# Altium project Guitar_Amp_Project.PrjPcb
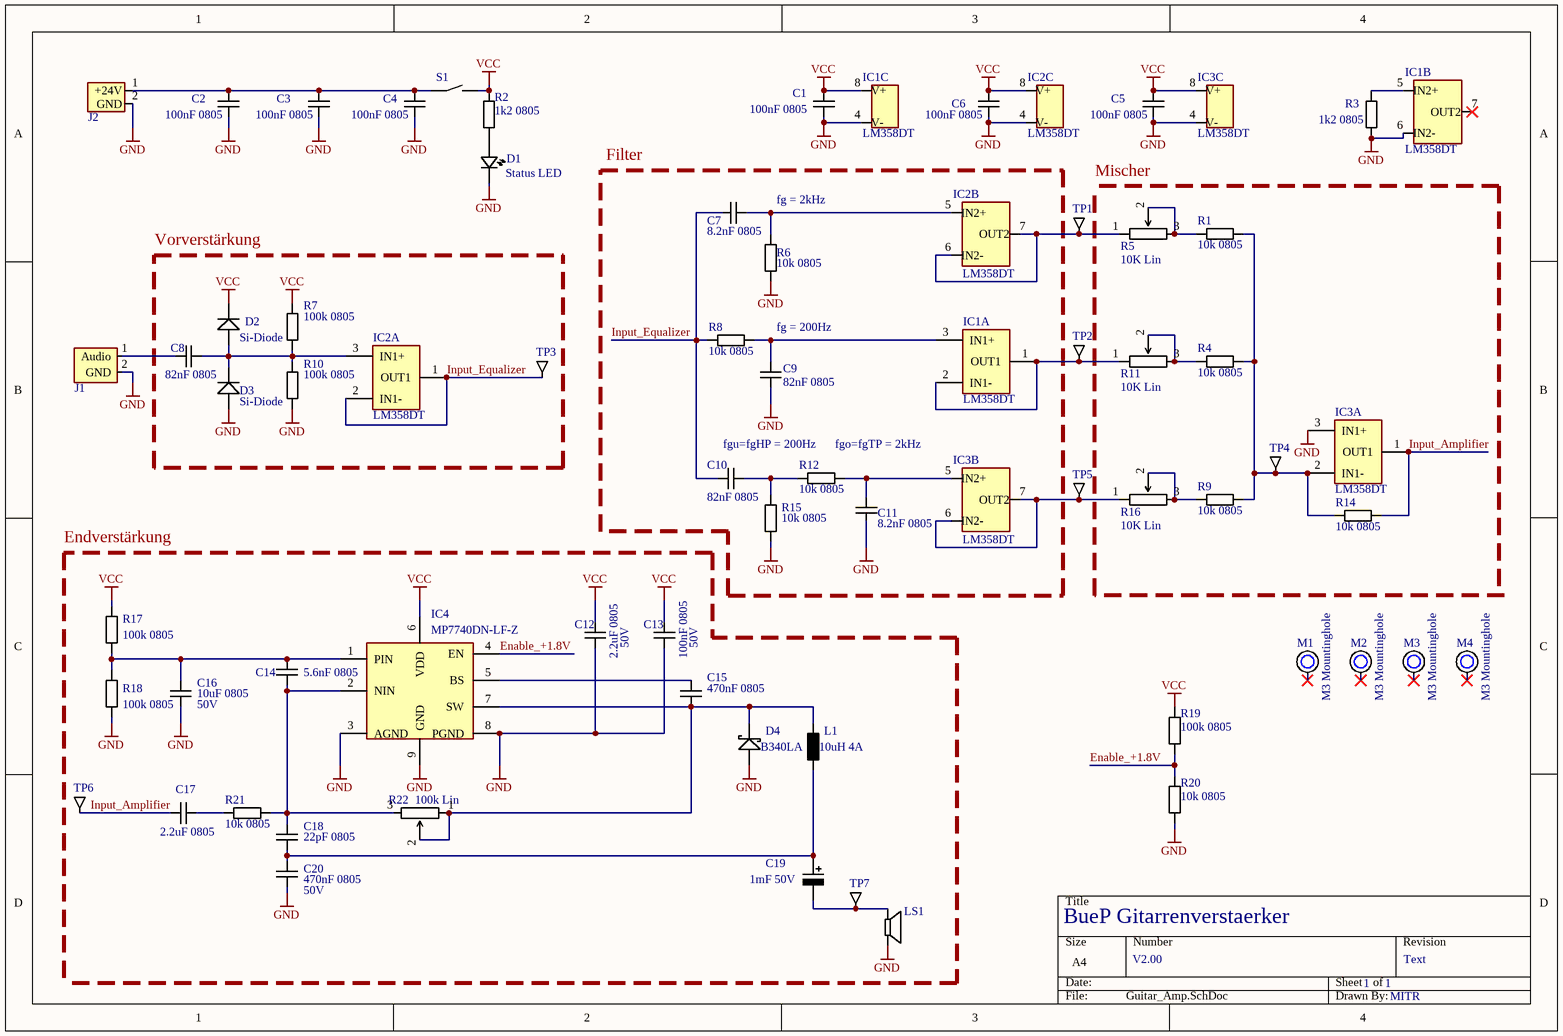
[diagram p0: Guitar_Amp.SchDoc]
1 sheet, 65 parts. Net scope: global (net labels, ports and power ports of the same name join across sheets).
Board file: Guitar_Amp_PCB.PcbDoc

## Sheet Guitar_Amp.SchDoc
size A4; SheetNumber: 1; SheetTotal: 1

### Parts
C1  100nF 0805  [C Template for 0805]
C2  100nF 0805  [C Template for 0805]
C3  100nF 0805  [C Template for 0805]
C4  100nF 0805  [C Template for 0805]
C5  100nF 0805  [C Template for 0805]
C6  100nF 0805  [C Template for 0805]
C7  8.2nF 0805  [C Template for 0805]
C8  82nF 0805  [C Template for 0805]
C9  82nF 0805  [C Template for 0805]
C10  82nF 0805  [C Template for 0805]
C11  8.2nF 0805  [C Template for 0805]
C12  2.2uF 0805  [C Template for 0805]
C13  100nF 0805  [C Template for 0805]
C14  5.6nF 0805  [C Template for 0805]
C15  470nF 0805  [C Template for 0805]
C16  10uF 0805  [C Template for 0805]
C17  2.2uF 0805  [C Template for 0805]
C18  22pF 0805  [C Template for 0805]
C19  1mF 50V  [C 1mF 50V Elko]
C20  470nF 0805  [C Template for 0805]
D1  ?F  [5mm LED Red]  (value not drawn)
D2  Si-Diode  [Si-Diode Footprint]
D3  Si-Diode  [Si-Diode Footprint]
D4  B340LA  [B340LA-13-F Schottky Diode]
IC1  LM358DT  [SOIC127P600X175-8N]  (parts A,B,C of 5)
IC2  LM358DT  [SOIC127P600X175-8N]  (parts A,B,C of 5)
IC3  LM358DT  [SOIC127P600X175-8N]  (parts A,B,C of 5)
IC4  MP7740DN-LF-Z  [SOIC127P600X170-9N]
J1  Audio-Jack  [Audio Inputjack]  (value not drawn)
J2  ?F 080  [Power Supply Input]  (value not drawn)
L1  10uH 4A  [Inductor 10uH / 4A]
LS1  4 Ohm  [4_Ohm_Speaker]  (value not drawn)
M1  M3 Mountinghole  [M3 Moutinghole]
M2  M3 Mountinghole  [M3 Moutinghole]
M3  M3 Mountinghole  [M3 Moutinghole]
M4  M3 Mountinghole  [M3 Moutinghole]
R1  10k 0805  [R Template for 0805]
R2  1k2 0805  [R Template for 0805]
R3  1k2 0805  [R Template for 0805]
R4  10k 0805  [R Template for 0805]
R5  10K Lin  [Poti_standard_footprint]
R6  10k 0805  [R Template for 0805]
R7  100k 0805  [R Template for 0805]
R8  10k 0805  [R Template for 0805]
R9  10k 0805  [R Template for 0805]
R10  100k 0805  [R Template for 0805]
R11  10K Lin  [Poti_standard_footprint]
R12  10k 0805  [R Template for 0805]
R14  10k 0805  [R Template for 0805]
R15  10k 0805  [R Template for 0805]
R16  10K Lin  [Poti_standard_footprint]
R17  100k 0805  [R Template for 0805]
R18  100k 0805  [R Template for 0805]
R19  100k 0805  [R Template for 0805]
R20  10k 0805  [R Template for 0805]
R21  10k 0805  [R Template for 0805]
R22  100k Lin  [Poti_standard_footprint]
S1  ?H 0805  [Switch]  (value not drawn)
TP1  Testpoint_2.54mm  [Testpoint_2.54mm]  (value not drawn)
TP2  Testpoint_2.54mm  [Testpoint_2.54mm]  (value not drawn)
TP3  Testpoint_2.54mm  [Testpoint_2.54mm]  (value not drawn)
TP4  Testpoint_2.54mm  [Testpoint_2.54mm]  (value not drawn)
TP5  Testpoint_2.54mm  [Testpoint_2.54mm]  (value not drawn)
TP6  Testpoint_2.54mm  [Testpoint_2.54mm]  (value not drawn)
TP7  Testpoint_2.54mm  [Testpoint_2.54mm]  (value not drawn)

### Blocks framed on the sheet
Filter: C7 C9-C11 IC1-IC3 R6 R8 R12 R15
Vorverstärkung: C8 D2 D3 IC2 R7 R10 TP3
Endverstärkung: C12-C20 D4 IC4 L1 LS1 R17 R18 R21 R22 TP6 TP7

### Nets
GND: C1.2 C2.2 C3.2 C4.2 C5.2 C6.2 C9.1 C11.1 C12.1 C13.1 C16.1 C20.1 D1.2(GND) D3.1 D4.1 IC1.4(V-) IC1.6(IN2-) IC2.4(V-) IC3.3(IN1+) IC3.4(V-) IC4.3(AGND) IC4.8(PGND) IC4.9(GND) J1.2(GND) J2.2(GND) LS1.2 R3.1 R6.1 R10.1 R15.1 R18.1 R20.1
VCC: C1.1 C5.1 C6.1 C12.2 C13.2 D2.2 IC1.8(V+) IC2.8(V+) IC3.8(V+) IC4.6(VDD) R2.2 R7.2 R17.2 R19.2 S1.1
Enable_+1.8V: IC4.4(EN) R19.1 R20.2
Input_Amplifier: C17.1 IC3.1(OUT1) R14.1 TP6.1
Input_Equalizer: C7.1 C10.1 IC2.1(OUT1) IC2.2(IN1-) R8.1 TP3.1
NetC2_1: C2.1 C3.1 C4.1 J2.1(+24V) S1.2
NetC7_2: C7.2 IC2.5(IN2+) R6.2
NetC8_1: C8.1 J1.1(Audio)
NetC8_2: C8.2 D2.1 D3.2 IC2.3(IN1+) R7.1 R10.2
NetC9_2: C9.2 IC1.3(IN1+) R8.2
NetC10_2: C10.2 R12.2 R15.2
NetC11_2: C11.2 IC3.5(IN2+) R12.1
NetC14_1: C14.1 C18.2 IC4.2(NIN) R21.1 R22.3(OUT9)
NetC14_2: C14.2 C16.2 IC4.1(PIN) R17.1 R18.2
NetC15_1: C15.1 D4.2 IC4.7(SW) L1.2 R22.1 R22.2
NetC15_2: C15.2 IC4.5(BS)
NetC17_2: C17.2 R21.2
NetC18_1: C18.1 C19.1 C20.2 L1.1
NetC19_2: C19.2 LS1.1 TP7.1
NetD1_1: D1.1(+24V) R2.1
NetIC1_1: IC1.1(OUT1) IC1.2(IN1-) R11.1 TP2.1
NetIC1_5: IC1.5(IN2+) R3.2
NetIC2_6: IC2.6(IN2-) IC2.7(OUT2) R5.1 TP1.1
NetIC3_2: IC3.2(IN1-) R1.2 R4.2 R9.2 R14.2 TP4.1
NetIC3_6: IC3.6(IN2-) IC3.7(OUT2) R16.1 TP5.1
NetR1_1: R1.1 R5.2 R5.3(OUT9)
NetR4_1: R4.1 R11.2 R11.3(OUT9)
NetR9_1: R9.1 R16.2 R16.3(OUT9)

Not connected (* = marked no-connect by the designer): IC1 7(OUT2)*; M1 1*; M2 1*; M3 1*; M4 1*

### Notes on the sheet
- (near D1) Status LED
- Mischer
- fg = 2kHz
- fg = 200Hz
- fgu=fgHP = 200Hz
- fgo=fgTP = 2kHz
- 50V
- (near C16) 50V
- (near C20) 50V
- BueP Gitarrenverstaerker
- V2.00
- 1
- Text
- MITR

### Library data of the parts
C1-C11 C13-C16 C18 C20 L1 R1-R4 R6-R10 R12 R14 R15 R17-R21 = RC0805FR-07100RP: Manufacturer_Name: KEMET; Geometry.Height: 0.6mm; Manufacturer_Part_Number: RC0805FR-07100RP; Mouser Part Number: 603-RC0805FR-07100RP; Mouser Price/Stock: https://www.mouser.co.uk/ProductDetail/YAGEO/RC0805FR-07100RP?qs=oypCK0zG324cSp99F0GBZw%3D%3D; Arrow Part Number: RC0805FR-07100RP; Arrow Price/Stock: https://www.arrow.com/en/products/rc0805fr-07100rp/yageo?region=nac; Datasheet Link: https://www.arrow.com/en/products/rc0805fr-07100rp/yageo?region=nac
C12 C17 = 2.2uF 0805: Manufacturer_Name: KEMET; Manufacturer_Part_Number: RC0805FR-07100RP; Geometry.Height: 0.6mm; Mouser Part Number: 603-RC0805FR-07100RP; Mouser Price/Stock: https://www.mouser.co.uk/ProductDetail/YAGEO/RC0805FR-07100RP?qs=oypCK0zG324cSp99F0GBZw%3D%3D; Arrow Part Number: RC0805FR-07100RP; Arrow Price/Stock: https://www.arrow.com/en/products/rc0805fr-07100rp/yageo?region=nac; Datasheet Link: https://www.arrow.com/en/products/rc0805fr-07100rp/yageo?region=nac
C19 = Electrolyte Capacitor: Mono Audio Input-Jack of Guitar; Manufacturer_Name: KEMET; Manufacturer_Part_Number: RC0805FR-07100RP; Geometry.Height: 0.6mm; Mouser Part Number: 603-RC0805FR-07100RP; Mouser Price/Stock: https://www.mouser.co.uk/ProductDetail/YAGEO/RC0805FR-07100RP?qs=oypCK0zG324cSp99F0GBZw%3D%3D; Arrow Part Number: RC0805FR-07100RP; Arrow Price/Stock: https://www.arrow.com/en/products/rc0805fr-07100rp/yageo?region=nac; Datasheet Link: https://www.arrow.com/en/products/rc0805fr-07100rp/yageo?region=nac
D1 = 5mm LED red: Manufacturer_Name: KEMET; Manufacturer_Part_Number: RC0805FR-07100RP; Geometry.Height: 0.6mm; Mouser Part Number: 603-RC0805FR-07100RP; Mouser Price/Stock: https://www.mouser.co.uk/ProductDetail/YAGEO/RC0805FR-07100RP?qs=oypCK0zG324cSp99F0GBZw%3D%3D; Arrow Part Number: RC0805FR-07100RP; Arrow Price/Stock: https://www.arrow.com/en/products/rc0805fr-07100rp/yageo?region=nac; Datasheet Link: https://www.arrow.com/en/products/rc0805fr-07100rp/yageo?region=nac
D2 D3 = Si-Diode: Manufacturer_Name: KEMET; Manufacturer_Part_Number: RC0805FR-07100RP; Geometry.Height: 0.6mm; Mouser Part Number: 603-RC0805FR-07100RP; Mouser Price/Stock: https://www.mouser.co.uk/ProductDetail/YAGEO/RC0805FR-07100RP?qs=oypCK0zG324cSp99F0GBZw%3D%3D; Arrow Part Number: RC0805FR-07100RP; Arrow Price/Stock: https://www.arrow.com/en/products/rc0805fr-07100rp/yageo?region=nac; Datasheet Link: https://www.arrow.com/en/products/rc0805fr-07100rp/yageo?region=nac
D4 = BL340LA-13-F: BL340LA-13-F SMA-Package; Manufacturer_Name: KEMET; Manufacturer_Part_Number: RC0805FR-07100RP; Geometry.Height: 0.6mm; Mouser Part Number: 603-RC0805FR-07100RP; Mouser Price/Stock: https://www.mouser.co.uk/ProductDetail/YAGEO/RC0805FR-07100RP?qs=oypCK0zG324cSp99F0GBZw%3D%3D; Arrow Part Number: RC0805FR-07100RP; Arrow Price/Stock: https://www.arrow.com/en/products/rc0805fr-07100rp/yageo?region=nac; Datasheet Link: https://www.arrow.com/en/products/rc0805fr-07100rp/yageo?region=nac
IC1-IC3 = LM358DT: LM358DT, Dual Operational Amplifier 1.1MHz 5 to 28V, 8-Pin SO; Manufacturer_Name: STMicroelectronics; Geometry.Height: 1.75mm; Manufacturer_Part_Number: LM358DT; Mouser Part Number: 511-LM358DT; Mouser Price/Stock: https://www.mouser.co.uk/ProductDetail/STMicroelectronics/LM358DT?qs=omvQGv%252BAfzDWfqgV6a5v9A%3D%3D; Arrow Part Number: LM358DT; Arrow Price/Stock: https://www.arrow.com/en/products/lm358dt/stmicroelectronics?region=europe; Datasheet Link: http://www.st.com/st-web-ui/static/active/en/resource/technical/document/datasheet/CD00000464.pdf
IC4 = MP7740DN-LF-Z: Audio Amplifiers 15W Class-D Mono Single End Audio Amp; Manufacturer_Name: Monolithic Power Systems (MPS); Geometry.Height: 1.7mm; Mouser Part Number: 946-MP7740DNLFZ; Mouser Price/Stock: https://www.mouser.co.uk/ProductDetail/Monolithic-Power-Systems-MPS/MP7740DN-LF-Z?qs=rC7bBWoQAAkZXpb7FkuwCg%3D%3D; Manufacturer_Part_Number: MP7740DN-LF-Z; Datasheet Link: https://componentsearchengine.com/Datasheets/1/MP7740DN-LF-Z.pdf
J1 = Audio-Jack: Mono Audio Input-Jack of Guitar; Manufacturer_Name: KEMET; Manufacturer_Part_Number: RC0805FR-07100RP; Geometry.Height: 0.6mm; Mouser Part Number: 603-RC0805FR-07100RP; Mouser Price/Stock: https://www.mouser.co.uk/ProductDetail/YAGEO/RC0805FR-07100RP?qs=oypCK0zG324cSp99F0GBZw%3D%3D; Arrow Part Number: RC0805FR-07100RP; Arrow Price/Stock: https://www.arrow.com/en/products/rc0805fr-07100rp/yageo?region=nac; Datasheet Link: https://www.arrow.com/en/products/rc0805fr-07100rp/yageo?region=nac
J2 = Power Supply Input Socket: Manufacturer_Name: KEMET; Manufacturer_Part_Number: RC0805FR-07100RP; Geometry.Height: 0.6mm; Mouser Part Number: 603-RC0805FR-07100RP; Mouser Price/Stock: https://www.mouser.co.uk/ProductDetail/YAGEO/RC0805FR-07100RP?qs=oypCK0zG324cSp99F0GBZw%3D%3D; Arrow Part Number: RC0805FR-07100RP; Arrow Price/Stock: https://www.arrow.com/en/products/rc0805fr-07100rp/yageo?region=nac; Datasheet Link: https://www.arrow.com/en/products/rc0805fr-07100rp/yageo?region=nac
LS1 = 4 Ohm Speaker: Manufacturer_Name: KEMET; Manufacturer_Part_Number: RC0805FR-07100RP; Geometry.Height: 0.6mm; Mouser Part Number: 603-RC0805FR-07100RP; Mouser Price/Stock: https://www.mouser.co.uk/ProductDetail/YAGEO/RC0805FR-07100RP?qs=oypCK0zG324cSp99F0GBZw%3D%3D; Arrow Part Number: RC0805FR-07100RP; Arrow Price/Stock: https://www.arrow.com/en/products/rc0805fr-07100rp/yageo?region=nac; Datasheet Link: https://www.arrow.com/en/products/rc0805fr-07100rp/yageo?region=nac
M1-M4 = M3 Mountinghole: Manufacturer_Name: KEMET; Manufacturer_Part_Number: RC0805FR-07100RP; Geometry.Height: 0.6mm; Mouser Part Number: 603-RC0805FR-07100RP; Mouser Price/Stock: https://www.mouser.co.uk/ProductDetail/YAGEO/RC0805FR-07100RP?qs=oypCK0zG324cSp99F0GBZw%3D%3D; Arrow Part Number: RC0805FR-07100RP; Arrow Price/Stock: https://www.arrow.com/en/products/rc0805fr-07100rp/yageo?region=nac; Datasheet Link: https://www.arrow.com/en/products/rc0805fr-07100rp/yageo?region=nac
R5 R11 R16 = 10k Linear Potentiometer: Manufacturer_Name: KEMET; Manufacturer_Part_Number: RC0805FR-07100RP; Geometry.Height: 0.6mm; Mouser Part Number: 603-RC0805FR-07100RP; Mouser Price/Stock: https://www.mouser.co.uk/ProductDetail/YAGEO/RC0805FR-07100RP?qs=oypCK0zG324cSp99F0GBZw%3D%3D; Arrow Part Number: RC0805FR-07100RP; Arrow Price/Stock: https://www.arrow.com/en/products/rc0805fr-07100rp/yageo?region=nac; Datasheet Link: https://www.arrow.com/en/products/rc0805fr-07100rp/yageo?region=nac
R22 = 100k Linear Potentiometer: Manufacturer_Name: KEMET; Manufacturer_Part_Number: RC0805FR-07100RP; Geometry.Height: 0.6mm; Mouser Part Number: 603-RC0805FR-07100RP; Mouser Price/Stock: https://www.mouser.co.uk/ProductDetail/YAGEO/RC0805FR-07100RP?qs=oypCK0zG324cSp99F0GBZw%3D%3D; Arrow Part Number: RC0805FR-07100RP; Arrow Price/Stock: https://www.arrow.com/en/products/rc0805fr-07100rp/yageo?region=nac; Datasheet Link: https://www.arrow.com/en/products/rc0805fr-07100rp/yageo?region=nac
S1 = Switch: Manufacturer_Name: KEMET; Manufacturer_Part_Number: RC0805FR-07100RP; Geometry.Height: 0.6mm; Mouser Part Number: 603-RC0805FR-07100RP; Mouser Price/Stock: https://www.mouser.co.uk/ProductDetail/YAGEO/RC0805FR-07100RP?qs=oypCK0zG324cSp99F0GBZw%3D%3D; Arrow Part Number: RC0805FR-07100RP; Arrow Price/Stock: https://www.arrow.com/en/products/rc0805fr-07100rp/yageo?region=nac; Datasheet Link: https://www.arrow.com/en/products/rc0805fr-07100rp/yageo?region=nac
TP1-TP7 = Testpoint_2.54mm: Manufacturer_Name: KEMET; Manufacturer_Part_Number: RC0805FR-07100RP; Geometry.Height: 0.6mm; Mouser Part Number: 603-RC0805FR-07100RP; Mouser Price/Stock: https://www.mouser.co.uk/ProductDetail/YAGEO/RC0805FR-07100RP?qs=oypCK0zG324cSp99F0GBZw%3D%3D; Arrow Part Number: RC0805FR-07100RP; Arrow Price/Stock: https://www.arrow.com/en/products/rc0805fr-07100rp/yageo?region=nac; Datasheet Link: https://www.arrow.com/en/products/rc0805fr-07100rp/yageo?region=nac